# Altium project absenc-26.PrjPcb
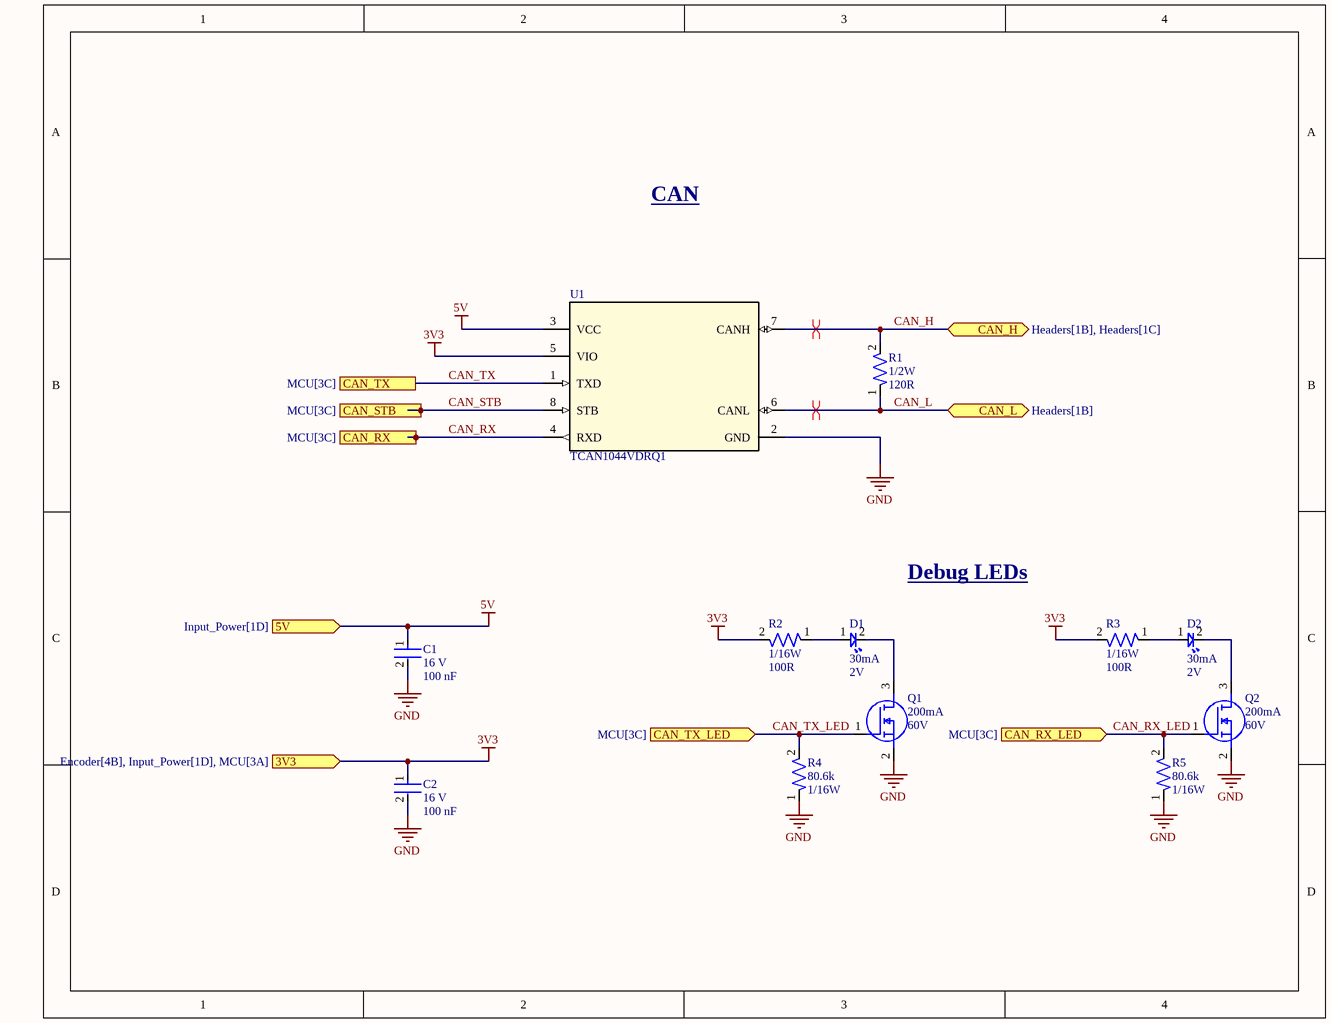
[diagram p0: CAN.SchDoc]
3 sheets, 20 parts. Net scope: flat (ports and power ports of the same name join across sheets).
Board file: PCB1.PcbDoc
Sheets:
  CAN.SchDoc
  Encoder.SchDoc
  Headers.SchDoc

## Sheet CAN.SchDoc
size A; SheetNumber: 1; SheetTotal: 5

### Parts
C1  Voltage Rating: 16 V  Capacitance: 100 nF  [CAP-0402]  (hidden comment: CC0402KRX7R7BB104)
C2  Voltage Rating: 16 V  Capacitance: 100 nF  [CAP-0402]  (hidden comment: CC0402KRX7R7BB104)
D1  Forward Current: 30mA  Forward Voltage: 2V  [LED-0603]  (hidden comment: BL-HKC36G-AV-TRB)
D2  Forward Current: 30mA  Forward Voltage: 2V  [LED-0603]  (hidden comment: BL-HKC36G-AV-TRB)
Q1  Continuous Current: 200mA  Voltage: 60V  [IC-SOT23-3]  (hidden comment: T2N7002AK,LM)
Q2  Continuous Current: 200mA  Voltage: 60V  [IC-SOT23-3]  (hidden comment: T2N7002AK,LM)
R1  Power: 1/2W  Resistance: 120R  [RES-1210]  (hidden comment: RC1210FR-07120RL)
R2  Power: 1/16W  Resistance: 100R  [RES-0402]  (hidden comment: RC0402FR-07100RL)
R3  Power: 1/16W  Resistance: 100R  [RES-0402]  (hidden comment: RC0402FR-07100RL)
R4  Resistance: 80.6k  Power: 1/16W  [RES-0402]  (hidden comment: RC0402FR-0780K6L)
R5  Resistance: 80.6k  Power: 1/16W  [RES-0402]  (hidden comment: RC0402FR-0780K6L)
U1  TCAN1044VDRQ1  [IC-8SOIC]

### Ports
3V3 (in, see Encoder[4B], Input_Power[1D], MCU[3A]), 5V (in, see Input_Power[1D]), CAN_H (bidir, see Headers[1B], Headers[1C]), CAN_L (bidir, see Headers[1B]), CAN_RX (see MCU[3C]), CAN_RX_LED (in, see MCU[3C]), CAN_STB (see MCU[3C]), CAN_TX (see MCU[3C]), CAN_TX_LED (in, see MCU[3C])

### Nets
3V3: C2.1 R2.2 R3.2 U1.5(VIO) ; port 3V3
5V: C1.1 U1.3(VCC) ; port 5V
GND: C1.2 C2.2 Q1.2(S) Q2.2(S) R4.1 R5.1 U1.2(GND)
CAN_H: R1.2 U1.7(CANH) ; port CAN_H
CAN_L: R1.1 U1.6(CANL) ; port CAN_L
CAN_RX: U1.4(RXD) ; port CAN_RX
CAN_RX_LED: Q2.1(G) R5.2 ; port CAN_RX_LED
CAN_STB: U1.8(STB) ; port CAN_STB
CAN_TX: U1.1(TXD) ; port CAN_TX
CAN_TX_LED: Q1.1(G) R4.2 ; port CAN_TX_LED
NetD1_1: D1.1 R2.1
NetD1_2: D1.2 Q1.3(D)
NetD2_1: D2.1 R3.1
NetD2_2: D2.2 Q2.3(D)

### Layout directives
differential pair: CAN_H, CAN_L

### Notes on the sheet
- CAN
- Debug LEDs

### Library data of the parts
C1 C2 = CAP-0.1U-0001: CAP CER 0.1UF 16V X7R 0402; ComponentLink2Description: Datasheet; ComponentLink2URL: https://www.yageo.com/upload/media/product/productsearch/datasheet/mlcc/UPY-GPHC_X7R_6.3V-to-250V_24.pdf; Device Class: Ceramic; Size: 0402
D1 D2 = LED-0001: LED YELLOW CLEAR 0603 SMD; ComponentLink1Description: Datasheet; ComponentLink1URL: https://www.americanbrightled.com/pdffiles/led-components/smt/BL-HKC36G-AV-TRB.pdf
Q1 Q2 = NMOS-200MA-0001: MOSFET N-CH 60V 200MA SOT23; ComponentLink1Description: Datasheet; ComponentLink1URL: https://toshiba.semicon-storage.com/info/T2N7002AK_datasheet_en_20150401.pdf?did=29712&prodName=T2N7002AK
R1 = RES-120-0001: RES 120 OHM 1% 1/2W 1210; Tolerance: 1%; Size: 1210; ComponentLink1Description: Datasheet; ComponentLink1URL: https://www.yageo.com/upload/media/product/products/datasheet/rchip/PYu-RC_Group_51_RoHS_L_12.pdf
R2 R3 = RES-100-0001: RES 100 OHM 1% 1/16W 0402; Tolerance: 1%; Size: 0402; ComponentLink1Description: Datasheet; ComponentLink1URL: https://www.yageo.com/upload/media/product/products/datasheet/rchip/PYu-RC_Group_51_RoHS_L_12.pdf
R4 R5 = RES-80.6k-0001: 80.6 kOhms ±1% 0.063W, 1/16W Chip Resistor 0402 (1005 Metric) Moisture Resistant Thick Film; Tolerance: 1%; Size: 0402; ComponentLink1Description: Datasheet; ComponentLink1URL: https://www.yageo.com/upload/media/product/products/datasheet/rchip/PYu-RC_Group_51_RoHS_L_12.pdf
U1 = IC-CAN-0001: IC TRANSCEIVER 1/1 8SOIC; ComponentLink1Description: Datasheet; ComponentLink1URL: https://www.ti.com/lit/ds/symlink/tcan1044-q1.pdf?HQS=dis-dk-null-digikeymode-dsf-pf-null-wwe&ts=1728758303289&ref_url=https%253A%252F%252Fwww.ti.com%252Fgeneral%252Fdocs%252Fsuppproductinfo.tsp%253FdistId%253D10%2526gotoUrl%253Dhttps%253A%252F%252Fwww.ti.com%252Flit%252Fgpn%252Ftcan1044-q1

## Sheet Encoder.SchDoc
size A; SheetNumber: 2; SheetTotal: 5
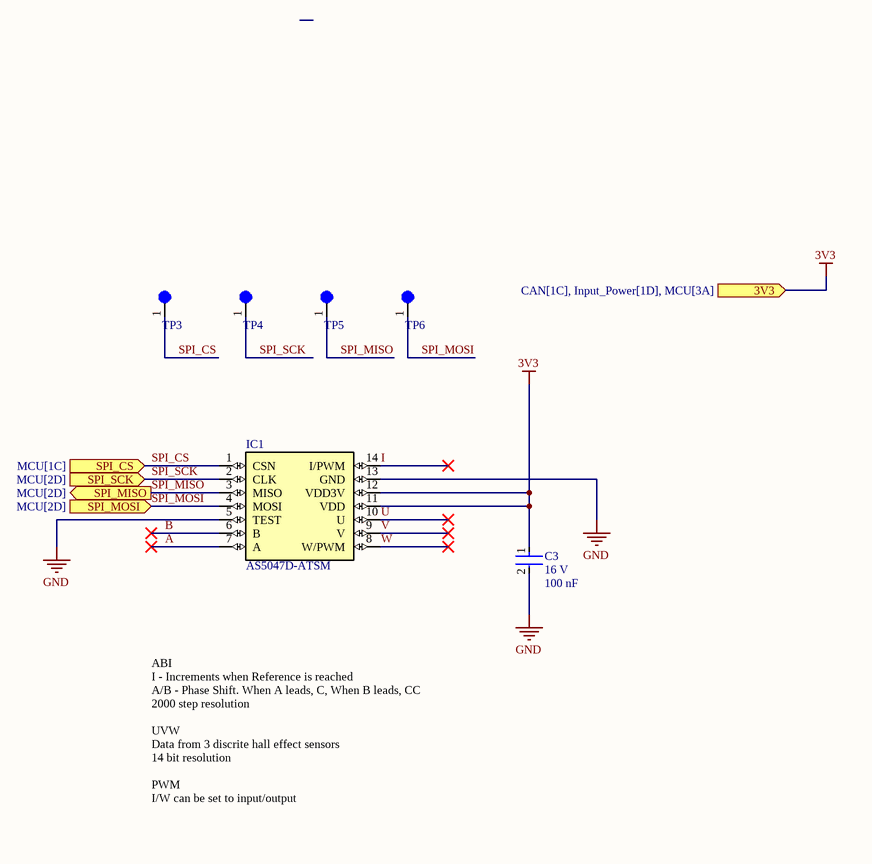
[diagram p1: Encoder.SchDoc]

### Parts
C3  Voltage Rating: 16 V  Capacitance: 100 nF  [CAP-0402]  (hidden comment: CC0402KRX7R7BB104)
IC1  AS5047D-ATSM  [SOP65P640X110-14N]
TP3  5003  [TEST02]  (value not drawn)
TP4  5003  [TEST02]  (value not drawn)
TP5  5003  [TEST02]  (value not drawn)
TP6  5003  [TEST02]  (value not drawn)

### Ports
3V3 (in, see CAN[1C], Input_Power[1D], MCU[3A]), SPI_CS (in, see MCU[1C]), SPI_MISO (out, see MCU[2D]), SPI_MOSI (in, see MCU[2D]), SPI_SCK (in, see MCU[2D])

### Nets
3V3: C3.1 IC1.11(VDD) IC1.12(VDD3V) ; port 3V3
GND: C3.2 IC1.5(TEST) IC1.13(GND)
A: IC1.7(A)
B: IC1.6(B)
I: IC1.14(I/PWM)
SPI_CS: IC1.1(CSN) TP3.1 ; port SPI_CS
SPI_MISO: IC1.3(MISO) TP5.1 ; port SPI_MISO
SPI_MOSI: IC1.4(MOSI) TP6.1 ; port SPI_MOSI
SPI_SCK: IC1.2(CLK) TP4.1 ; port SPI_SCK
U: IC1.10(U)
V: IC1.9(V)
W: IC1.8(W/PWM)

### Notes on the sheet
- ABI
  I - Increments when Reference is reached
  A/B - Phase Shift. When A leads, C, When B leads, CC
  2000 step resolution
  UVW
  Data from 3 discrite hall effect sensors
  14 bit resolution
  PWM
  I/W can be set to input/output

### Library data of the parts
C3 = CAP-0.1U-0001: CAP CER 0.1UF 16V X7R 0402; ComponentLink2Description: Datasheet; ComponentLink2URL: https://www.yageo.com/upload/media/product/productsearch/datasheet/mlcc/UPY-GPHC_X7R_6.3V-to-250V_24.pdf; Device Class: Ceramic; Size: 0402
IC1 = IC-ABSENC-0001: Hall Effect Sensor Rotary Position External Magnet, Not Included Gull Wing; MF: ams; SnapEDA_Link: https://www.snapeda.com/parts/AS5047D-ATSM/ams/view-part/?ref=snap; Package: TSSOP-14 ams; Value: *; MP: AS5047D-ATSM; Check_prices: https://www.snapeda.com/parts/AS5047D-ATSM/ams/view-part/?ref=eda; ComponentLink1Description: Datasheet; ComponentLink1URL: https://www.mouser.com/datasheet/3/5912/1/AS5047U_DS000637_1_01.pdf
TP3-TP6 = TEST-POINT-0002: Surface Mount

## Sheet Headers.SchDoc
size A; SheetNumber: 5; SheetTotal: 5
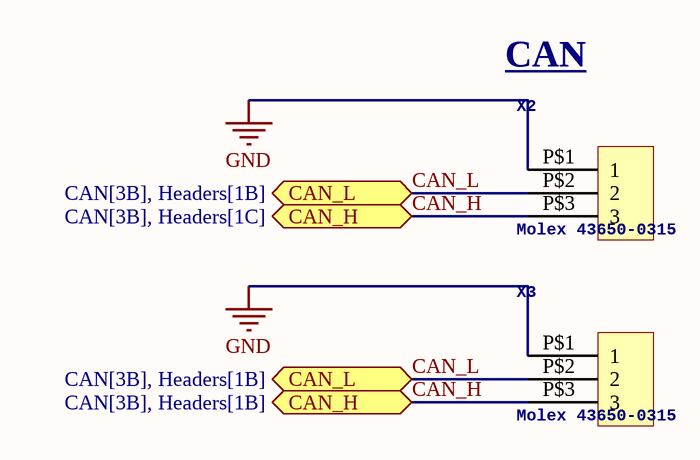
[diagram p2: Headers.SchDoc]

### Parts
X2  Molex 43650-0315  [43650-0315]
X3  Molex 43650-0315  [43650-0315]

### Ports
CAN_H (bidir, see CAN[3B], Headers[1B]), CAN_H (bidir, see CAN[3B], Headers[1C]), CAN_L (bidir, see CAN[3B], Headers[1B])

### Nets
GND: X2.P$1(1) X3.P$1(1)
CAN_H: X2.P$3(3) X3.P$3(3) ; port CAN_H
CAN_L: X2.P$2(2) X3.P$2(2) ; port CAN_L

### Notes on the sheet
- CAN

### Library data of the parts
X2 X3 = Micro-Fit Molex 3 Pin Vertical: GateName_1: G$1; SymbolName_1: HEADER_POS3; DeviceSetName: HEADER_POS3_?; DeviceName: 43650-0315; LibraryName: con-molex-micro-fit-3_0_2; Package: 43650-0315

## Nets that join several sheets
3V3: CAN (C2.1 R2.2 R3.2 U1.5), Encoder (C3.1 IC1.11 IC1.12)
GND: CAN (7 pins), Encoder (C3.2 IC1.5 IC1.13), Headers (X2.P$1 X3.P$1)
CAN_H: CAN (R1.2 U1.7), Headers (X2.P$3 X3.P$3)
CAN_L: CAN (R1.1 U1.6), Headers (X2.P$2 X3.P$2)